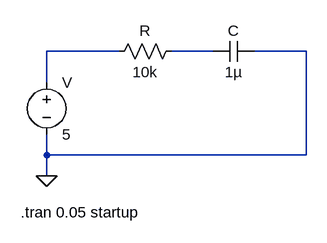
[diagram p0: schematic T2_3_RC_tran.asc]
T2_3_RC_tran.asc, the LTspice schematic file:
Version 4
SHEET 1 880 680
WIRE 240 32 128 32
WIRE 384 32 320 32
WIRE 528 32 448 32
WIRE 128 80 128 32
WIRE 128 192 128 160
WIRE 528 192 528 32
WIRE 528 192 128 192
WIRE 128 224 128 192
FLAG 128 224 0
SYMBOL voltage 128 64 R0
WINDOW 123 0 0 Left 0
WINDOW 39 0 0 Left 0
SYMATTR InstName V
SYMATTR Value 5
SYMBOL res 336 16 R90
WINDOW 0 0 56 VBottom 2
WINDOW 3 32 56 VTop 2
SYMATTR InstName R
SYMATTR Value 10k
SYMBOL cap 448 16 R90
WINDOW 0 0 32 VBottom 2
WINDOW 3 32 32 VTop 2
SYMATTR InstName C
SYMATTR Value 1µ
TEXT 88 280 Left 2 !.tran 0.05 startup

The netlist it stands for:
* T2_3_RC_tran.asc
V N001 0 5
R N002 N001 10k
C 0 N002 1µ
.tran 0.05 startup
.backanno
.end